# EAGLE design ESP32-Proto2-OSHPARK_Rev2 (EAGLE 9.6.2)
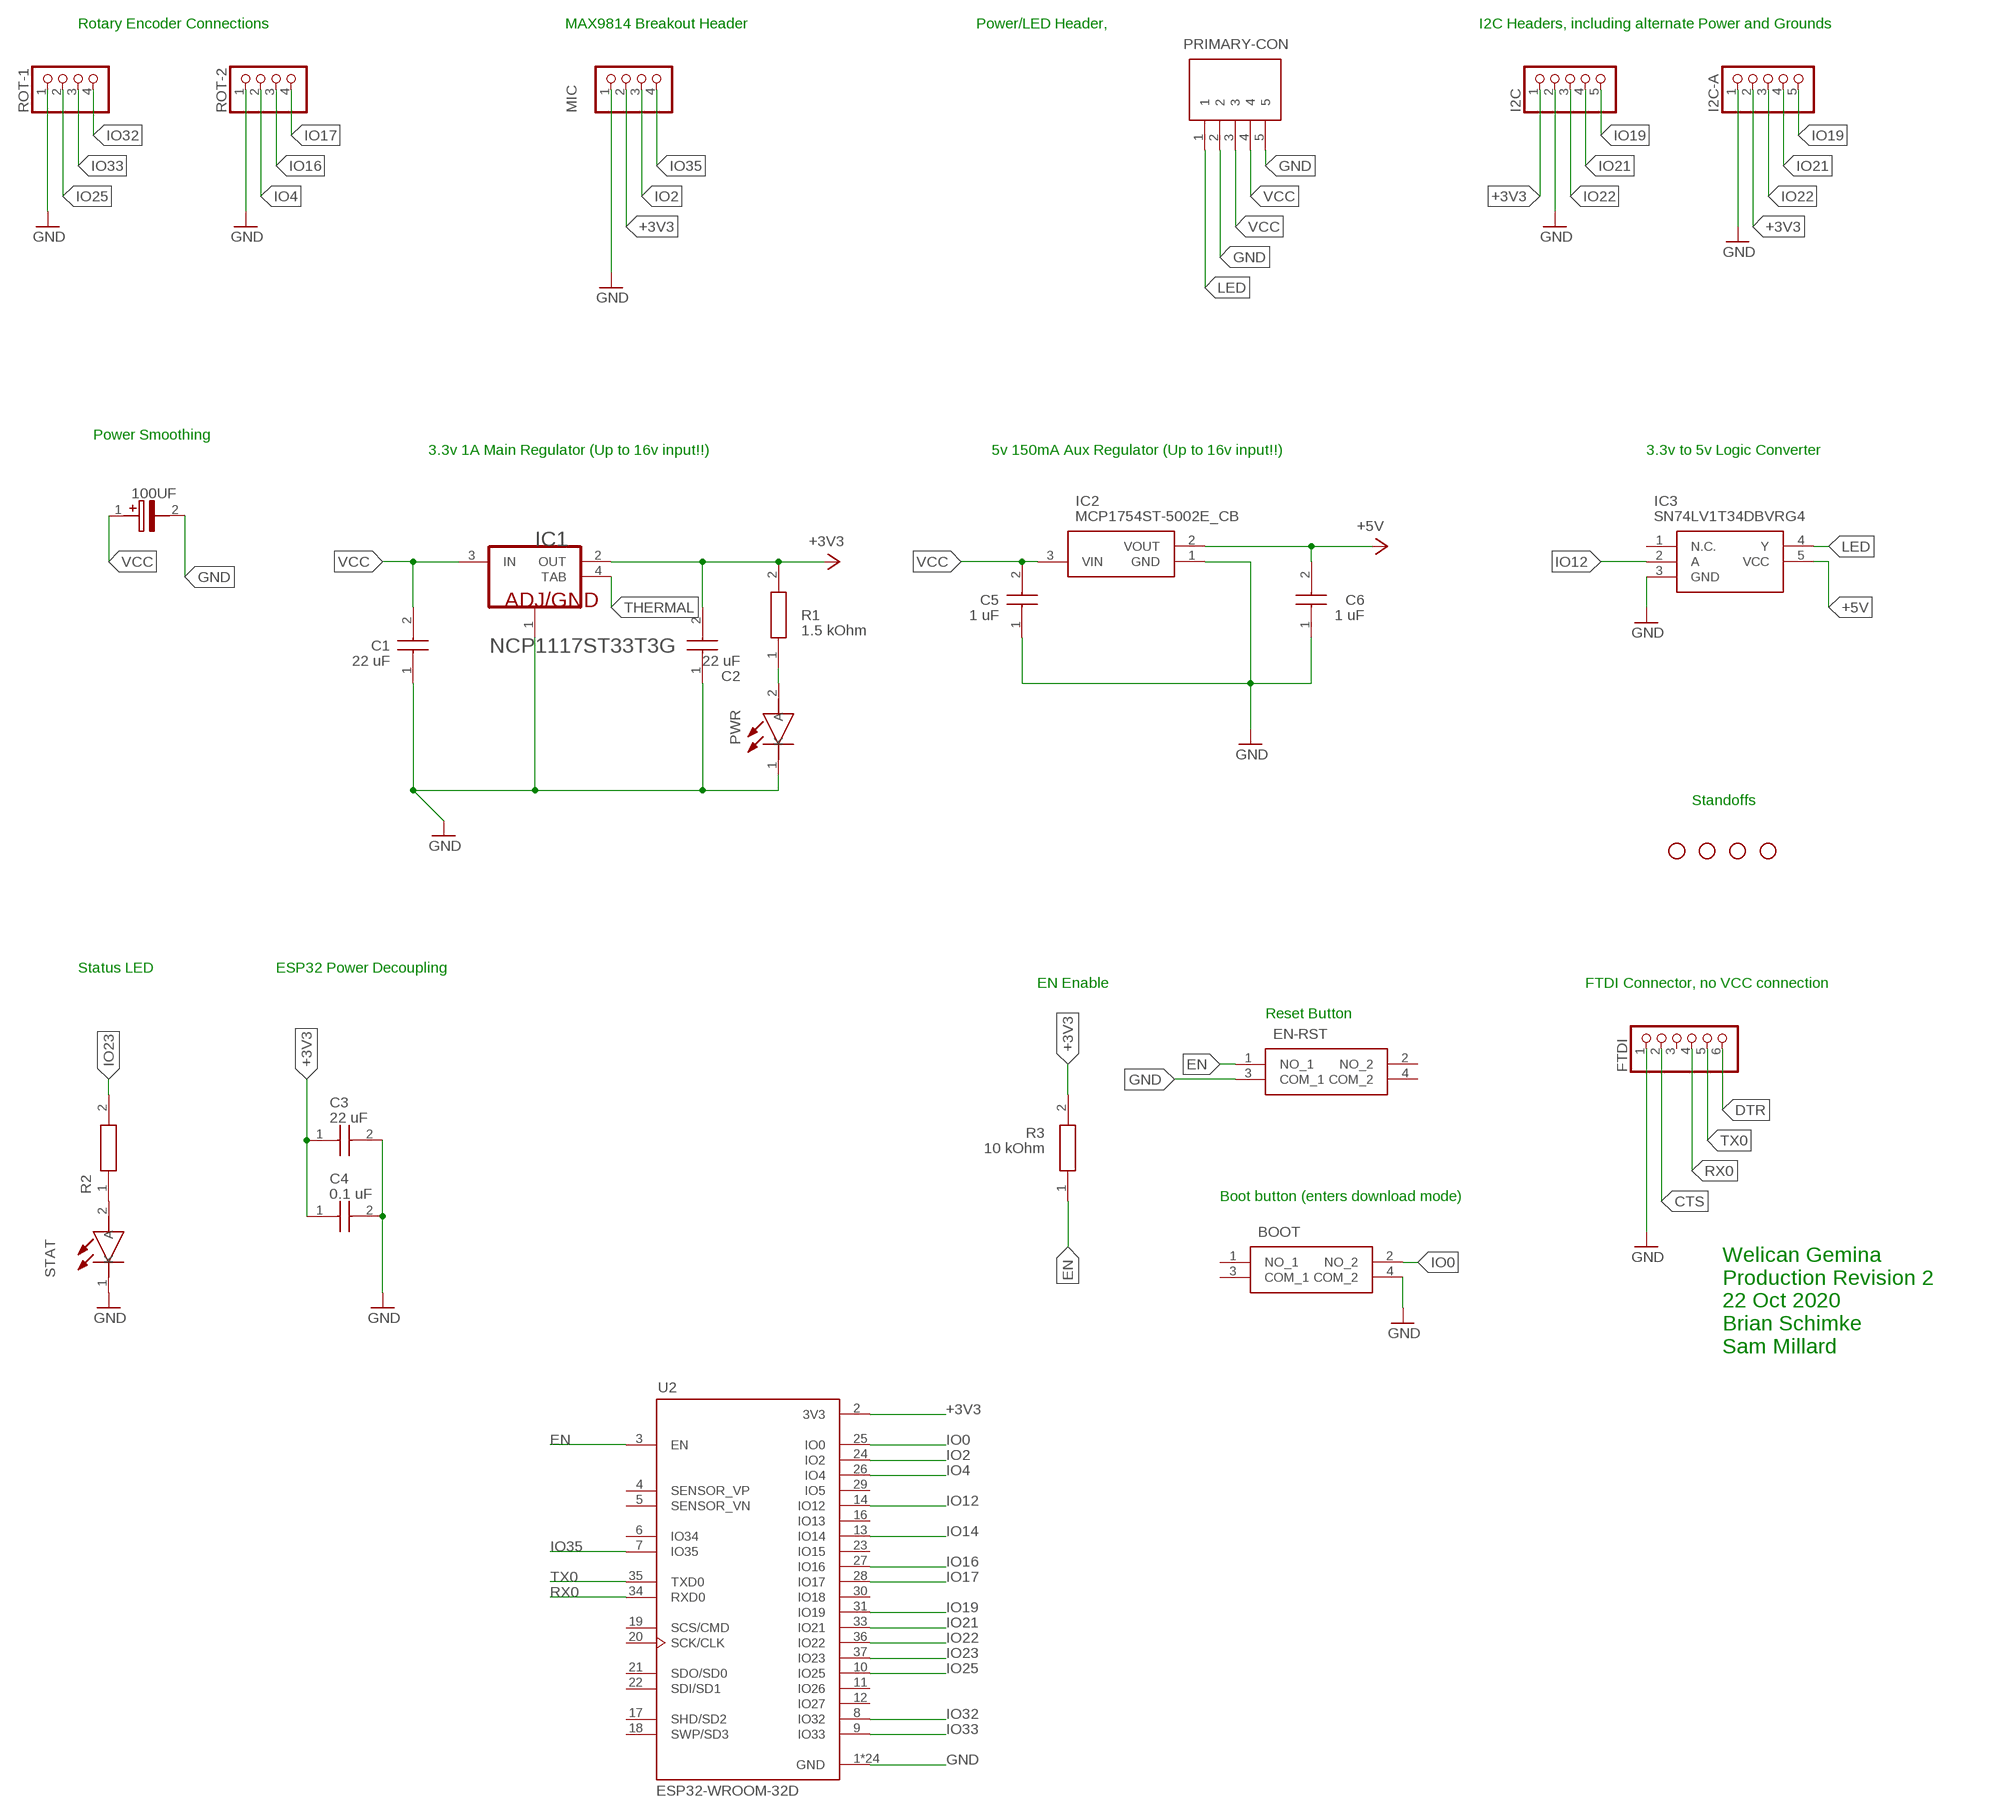
[diagram p0: schematic, sheet 1]

## Parts
100UF  865080445010  [CAPAE660X770N]
BOOT  PTS647SK70SMTR2LFS  [PTS647SK70SMTR2LFS]
C1  22 uF  C1206C226M4PACTU  [CAPC3216X180N]
C2  22 uF  C1206C226M4PACTU  [CAPC3216X180N]
C3  22 uF  C1206C226M4PACTU  [CAPC3216X180N]
C4  0.1 uF  C1206C226M4PACTU  [CAPC3216X180N]
C5  1 uF  C1206C226M4PACTU  [CAPC3216X180N]
C6  1 uF  C1206C226M4PACTU  [CAPC3216X180N]
EN-RST  PTS647SK70SMTR2LFS  [PTS647SK70SMTR2LFS]
FTDI  PINHD-1X6  [1X06]
H1  STAND-OFF  [STAND-OFF]
H2  STAND-OFF  [STAND-OFF]
H3  STAND-OFF  [STAND-OFF]
H4  STAND-OFF  [STAND-OFF]
I2C  PINHD-1X5  [1X05]
I2C-A  PINHD-1X5  [1X05]
IC1  ON_SEMICONDUCTOR_NCP1117ST33T3GON_SEMICONDUCTOR_NCP1117ST33T3G_0_0  [ON_SEMICONDUCTOR_NCP1117ST33T3G_0]
IC2  MCP1754ST-5002E_CB  [SOT95P255X145-3N]
IC3  SN74LV1T34DBVRG4  [SOT95P280X145-5N]
MIC  PINHD-1X4  [1X04]
PRIMARY-CON  1984646  [1984646]
PWR  150120AS75000  [LEDSC320X160X78-2N]
R1  1.5 kOhm  CRCW12061K00FKEB  [RESC3216X60N]
R2  CRCW12061K00FKEB  [RESC3216X60N]
R3  10 kOhm  CRCW12061K00FKEB  [RESC3216X60N]
ROT-1  PINHD-1X4  [1X04]
ROT-2  PINHD-1X4  [1X04]
STAT  150120AS75000  [LEDSC320X160X78-2N]
U2  ESP32-WROOM-32D  [MODULE_ESP32-WROOM-32D]

## Nets
+3V3: C2.2 C3.1 C4.1 I2C-A.2 I2C.1 IC1.2(OUT) MIC.2 R1.2 R3.2 U2.2(3V3)
+5V: C6.2 IC2.2(VOUT) IC3.5(VCC)
CTS: FTDI.2
DTR: FTDI.6
EN: EN-RST.1(NO_1) R3.1 U2.3(EN)
GND: 100UF.2(-) BOOT.4(COM_2) C1.1 C2.1 C3.2 C4.2 C5.1 C6.1 EN-RST.3(COM_1) FTDI.1 I2C-A.1 I2C.2 IC1.1(ADJ/GND) IC2.1(GND) IC3.3(GND) MIC.1 PRIMARY-CON.2 PRIMARY-CON.5 PWR.1(K) ROT-1.1 ROT-2.1 STAT.1(K) U2.1(GND) U2.15(GND) U2.38(GND) U2.39_1(GND) U2.39_2(GND) U2.39_3(GND) U2.39_4(GND) U2.39_5(GND) U2.39_6(GND) U2.39_7(GND) U2.39_8(GND) U2.39_9(GND) U2.39_10(GND) U2.39_11(GND) U2.39_12(GND) U2.39_13(GND) U2.39_14(GND) U2.39_15(GND) U2.39_16(GND) U2.39_17(GND) U2.39_18(GND) U2.39_19(GND) U2.39_20(GND) U2.39_21(GND)
IO0: BOOT.2(NO_2) U2.25(IO0)
IO2: MIC.3 U2.24(IO2)
IO4: ROT-2.2 U2.26(IO4)
IO12: IC3.2(A) U2.14(IO12)
IO14: U2.13(IO14)
IO16: ROT-2.3 U2.27(IO16)
IO17: ROT-2.4 U2.28(IO17)
IO19: I2C-A.5 I2C.5 U2.31(IO19)
IO21: I2C-A.4 I2C.4 U2.33(IO21)
IO22: I2C-A.3 I2C.3 U2.36(IO22)
IO23: R2.2 U2.37(IO23)
IO25: ROT-1.2 U2.10(IO25)
IO32: ROT-1.4 U2.8(IO32)
IO33: ROT-1.3 U2.9(IO33)
IO35: MIC.4 U2.7(IO35)
LED: IC3.4(Y) PRIMARY-CON.1
N$1: PWR.2(A) R1.1
N$2: R2.1 STAT.2(A)
RX0: FTDI.4 U2.34(RXD0)
THERMAL: IC1.4(TAB)
TX0: FTDI.5 U2.35(TXD0)
VCC: 100UF.1(+) C1.2 C5.2 IC1.3(IN) IC2.3(VIN) PRIMARY-CON.3 PRIMARY-CON.4
Unconnected: BOOT.1(NO_1) BOOT.3(COM_1) EN-RST.2(NO_2) EN-RST.4(COM_2) FTDI.3 IC3.1(N.C.) U2.4(SENSOR_VP) U2.5(SENSOR_VN) U2.6(IO34) U2.11(IO26) U2.12(IO27) U2.16(IO13) U2.17(SHD/SD2) U2.18(SWP/SD3) U2.19(SCS/CMD) U2.20(SCK/CLK) U2.21(SDO/SD0) U2.22(SDI/SD1) U2.23(IO15) U2.29(IO5) U2.30(IO18)

## Notes on the sheet
- Rotary Encoder Connections | MAX9814 Breakout Header | Power/LED Header, | I2C Headers, including alternate Power and Grounds
- Power Smoothing
- 3.3v 1A Main Regulator (Up to 16v input!!) | 5v 150mA Aux Regulator (Up to 16v input!!) | 3.3v to 5v Logic Converter
- Standoffs
- Status LED | ESP32 Power Decoupling
- EN Enable | FTDI Connector, no VCC connection
- Reset Button
- Boot button (enters download mode)
- Welican Gemina
  Production Revision 2
  22 Oct 2020
  Brian Schimke
  Sam Millard

## Library data of the parts
100UF = SamacSys_Parts:865080445010: Wurth Elektronik Aluminium Electrolytic Capacitor 100uF 25V dc 6.3mm V-Chip WCAP-ASLI Series Aluminium, Surface Mount Source: Datasheet <https://katalog.we-online.com/pbs/datasheet/865080445010.pdf>; DESCRIPTION: Wurth Elektronik Aluminium Electrolytic Capacitor 100uF 25V dc 6.3mm V-Chip WCAP-ASLI Series Aluminium, Surface Mount; HEIGHT: 7.7mm; MANUFACTURER_NAME: Wurth Elektronik; MANUFACTURER_PART_NUMBER: 865080445010; MOUSER_PART_NUMBER: 710-865080445010; MOUSER_PRICE-STOCK: https://www.mouser.co.uk/ProductDetail/Wurth-Elektronik/865080445010?qs=0KOYDY2FL29KjsP7WHszFQ%3D%3D
BOOT EN-RST = SamacSys_Parts:PTS647SK70SMTR2LFS: Tactile Switches 50mA 12VDC, 2.5N 7.0mm H, G leads Source: Datasheet <https:////www.ckswitches.com/media/2567/pts647.pdf>; DESCRIPTION: Tactile Switches 50mA 12VDC, 2.5N 7.0mm H, G leads; HEIGHT: 7.2mm; MANUFACTURER_NAME: C & K COMPONENTS; MANUFACTURER_PART_NUMBER: PTS647SK70SMTR2LFS; MOUSER_PART_NUMBER: 611-PTS647SK70SMTR2L; MOUSER_PRICE-STOCK: https://www.mouser.co.uk/ProductDetail/CK/PTS647SK70SMTR2LFS?qs=PqoDHHvF64%2FG2CdR6DYUFw%3D%3D
C1-C6 = SamacSys_Parts:C1206C226M4PACTU: KEMET 1206 (3216M) 22uF MLCC 16V dc +/-20% SMD C1206C226M4PACTU Source: Datasheet <https://api.kemet.com/component-edge/download/specsheet/C1206C226M4PACTU.pdf>; DESCRIPTION: KEMET 1206 (3216M) 22uF MLCC 16V dc +/-20% SMD C1206C226M4PACTU; HEIGHT: 1.8mm; MANUFACTURER_NAME: Kemet; MANUFACTURER_PART_NUMBER: C1206C226M4PACTU; MOUSER_PART_NUMBER: 80-C1206C226M4P; MOUSER_PRICE-STOCK: https://www.mouser.co.uk/ProductDetail/KEMET/C1206C226M4PACTU?qs=vBH1GPjCw2UZFSd%252B4IU1Qg%3D%3D
FTDI = pinhead:PINHD-1X6: PIN HEADER
H1-H4 = SparkFun-Hardware:STAND-OFF: Stand Off Drill holes for mechanically mounting via screws, standoffs, etc. Note: Use the keepout ring to avoid running the screw head into surrounding components. Variant Overviews STAND-OFF - Mechanical footprint for a #4 phillips button head screw. STAND-OFF-TIGHT - Mechanical footprint for a #4 phillips button head screw, Example SparkFun Products Screw - Phillips Head (1/4", 4-40, 10 pack) <https://www.sparkfun.com/products/10453> (PRT-10453) Screw - Phillips Head (1/2", 4-40, 10 pack) <https://www.sparkfun.com/products/10452> (PRT-10452) Screw - Phillips Head (3/4", 4-40, 10 pack) <https://www.sparkfun.com/products/10451> (PRT-10451) Screw - Phillips Head (1", 4-40, 10 pack) <https://www.sparkfun.com/products/10450> (PRT-10450)
I2C I2C-A = pinhead:PINHD-1X5: PIN HEADER
IC1 = ON Semiconductor - NCP1117ST33T3G:ON_SEMICONDUCTOR_NCP1117ST33T3G: ONSC-NCP1117-SOT223-4; CASE_CODE_IMPERIAL: 0603; CASE_CODE_METRIC: 1608; CASE_PACKAGE: 0603; CIIVA_IDS: 19354120; COMPONENT_LINK_1_DESCRIPTION: Manufacturer URL; COMPONENT_LINK_1_URL: http://www.onsemi.com/; DATASHEET: http://www.onsemi.com/pub_link/Collateral/NCP1117-D.PDF; DATASHEET_VERSION: Rev. 27, 09/2014; FOOTPRINT_VARIANT_NAME_0: Manufacturer Recommended; HEIGHT: 0.45 mm; IMPORTED: yes; IMPORTED_FROM: vault; IMPORT_TS: 1521845423; LENGTH: 1.55 mm; MAX_OPERATING_TEMPERATURE: 155 degC; MF: ON Semiconductor; MIN_OPERATING_TEMPERATURE: -55 degC; MOUNT: Surface Mount; MPN: NCP1117ST33T3G; PACKAGE: SOT-223-4-318H-01_A; PACKAGE_DESCRIPTION: 4-Pin Small Outline Transistor, Body 6.5 x 3.5 mm, Pitch 2.3 mm; PACKAGE_QUANTITY: 5000; PACKAGING: Tape and Reel; POWER_RATING: 100 mW; PREFIX: U; RADIATION_HARDENING: No; REACH_SVHC: Unknown; RELEASE_DATE: 1475065185; RESISTANCE: 220 kohm; RO_HSCOMPLIANT: true; TOLERANCE: 1%; TYPE_RESISTOR: Thick Film; VAULT_GUID: C6E429D0-32F2-4CA3-9C68-29F3FC9DADEB; VAULT_REVISION: 6AD56B9F-4B97-41F2-91E8-97C557B92B31; VOLTAGE_RATING: 75 V; WEIGHT: 7.1E-05 oz; WIDTH: 0.85 mm
IC2 = SamacSys_Parts:MCP1754ST-5002E_CB: LDO regulator,voltage,5.0V,150mA,SOT23A Microchip MCP1754ST-5002E/CB, Single Linear Voltage Regulator, 150mA 5 V, 2%, 3-Pin SOT-23A Source: Datasheet; DESCRIPTION: LDO regulator,voltage,5.0V,150mA,SOT23A Microchip MCP1754ST-5002E/CB, Single Linear Voltage Regulator, 150mA 5 V, 2%, 3-Pin SOT-23A; HEIGHT: 1.45mm; MANUFACTURER_NAME: Microchip; MANUFACTURER_PART_NUMBER: MCP1754ST-5002E/CB; MOUSER_PART_NUMBER: 579-MCP1754T-5002ECB; MOUSER_PRICE-STOCK: https://www.mouser.co.uk/ProductDetail/Microchip-Technology/MCP1754ST-5002E-CB?qs=geWWqIMx8YpBnNSotTcMsA%3D%3D
IC3 = SamacSys_Parts:SN74LV1T34DBVRG4: Single Power Supply BUFFER Logic Level Shifter (no enable) Source: Datasheet <http://www.ti.com/lit/gpn/sn74lv1t34>; DESCRIPTION: Single Power Supply BUFFER Logic Level Shifter (no enable); HEIGHT: 1.45mm; MANUFACTURER_NAME: Texas Instruments; MANUFACTURER_PART_NUMBER: SN74LV1T34DBVRG4; MOUSER_PART_NUMBER: 595-SN74LV1T34DBVRG4; MOUSER_PRICE-STOCK: https://www.mouser.co.uk/ProductDetail/Texas-Instruments/SN74LV1T34DBVRG4?qs=vdi0iO8H4N10R%252Bt%252BjmxZrg%3D%3D
MIC ROT-1 ROT-2 = pinhead:PINHD-1X4: PIN HEADER
PRIMARY-CON = SamacSys_Parts:1984646: Phoenix Contact, COMBICON PT 3.5mm Pitch, 5 Way PCB Terminal Strip Source: Datasheet <https://www.phoenixcontact.com/online/portal/in?uri=pxc-oc-itemdetail:pid=1984646&library=inen&tab=1>; DESCRIPTION: Phoenix Contact, COMBICON PT 3.5mm Pitch, 5 Way PCB Terminal Strip; HEIGHT: 9.3mm; MANUFACTURER_NAME: Phoenix Contact; MANUFACTURER_PART_NUMBER: 1984646
PWR STAT = SamacSys_Parts:150120AS75000: WL-SMCW SMD chip LED top view monocolor%D waterclear Source: Datasheet <http://katalog.we-online.com/led/datasheet/150120AS75000.pdf>; DESCRIPTION: WL-SMCW SMD chip LED top view monocolor%D waterclear; HEIGHT: mm; MANUFACTURER_NAME: Wurth Elektronik; MANUFACTURER_PART_NUMBER: 150120AS75000; MOUSER_PART_NUMBER: 710-150120AS75000; MOUSER_PRICE-STOCK: https://www.mouser.co.uk/ProductDetail/Wurth-Elektronik/150120AS75000?qs=LlUlMxKIyB3dthGDbNsiXQ%3D%3D
R1-R3 = SamacSys_Parts:CRCW12061K00FKEB: Thick Film Resistors - SMD 1/4watt 1Kohms 1% Source: Datasheet <http://www.vishay.com/docs/20035/dcrcwe3.pdf>; DESCRIPTION: Thick Film Resistors - SMD 1/4watt 1Kohms 1%; HEIGHT: 0.6mm; MANUFACTURER_NAME: Vishay; MANUFACTURER_PART_NUMBER: CRCW12061K00FKEB; MOUSER_PART_NUMBER: 71-CRCW12061K00FKEB; MOUSER_PRICE-STOCK: https://www.mouser.co.uk/ProductDetail/Vishay-Dale/CRCW12061K00FKEB?qs=3XLFQ9LoC1wOYUVdt2fbOg%3D%3D
U2 = ESP32-WROOM-32D:ESP32-WROOM-32D: Bluetooth, WiFi 802.11b/g/n, Bluetooth v4.2 + EDR, Class 1, 2 and 3 Transceiver Module 2.4GHz ~ 2.5GHz Integrated, Trace Surface Mount Check prices <https://pricing.snapeda.com/search/part/ESP32-WROOM-32D/?ref=eda>; AVAILABILITY: Bad; DESCRIPTION: Bluetooth, WiFi 802.11b/g/n, Bluetooth v4.2 +EDR, Class 1, 2 and 3 Transceiver Module 2.4GHz ~ 2.5GHz Integrated, Trace Surface Mount; MF: Espressif Systems; MP: ESP32-WROOM-32D; PACKAGE: Module Espressif Systems; PRICE: None

## Board
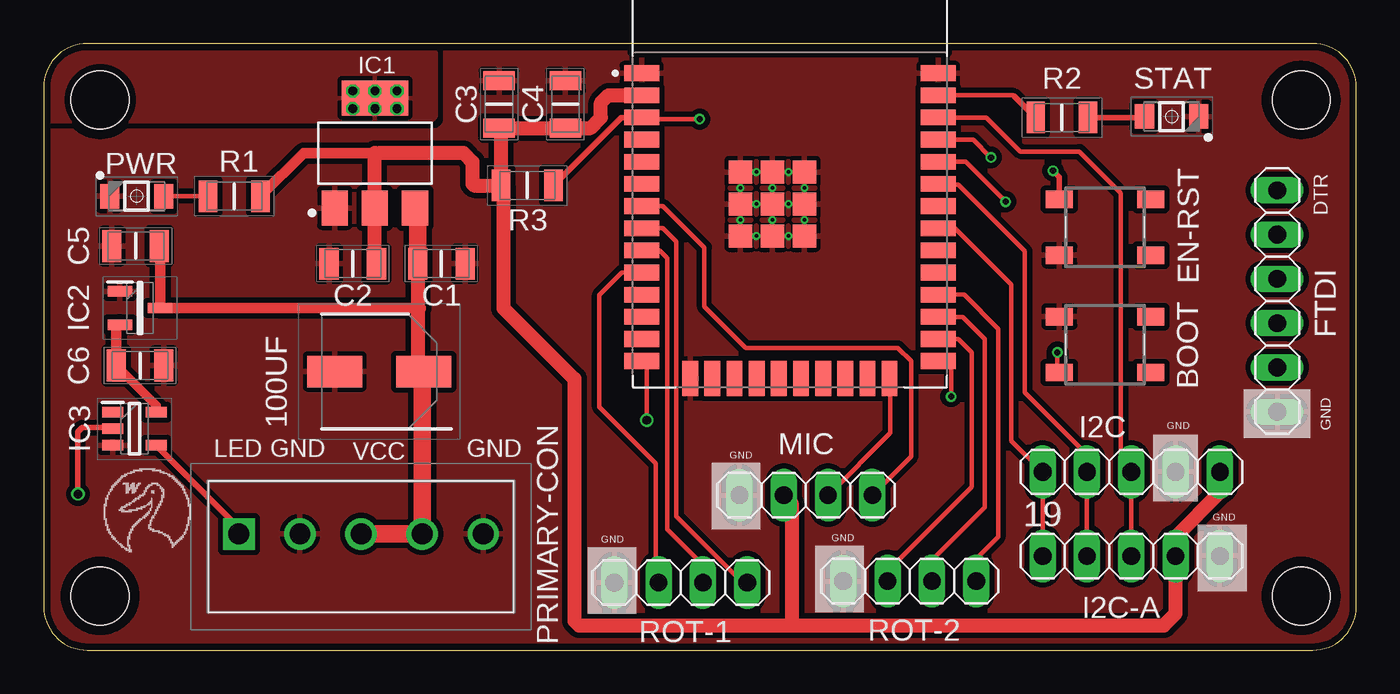
[diagram p1: board, top side]
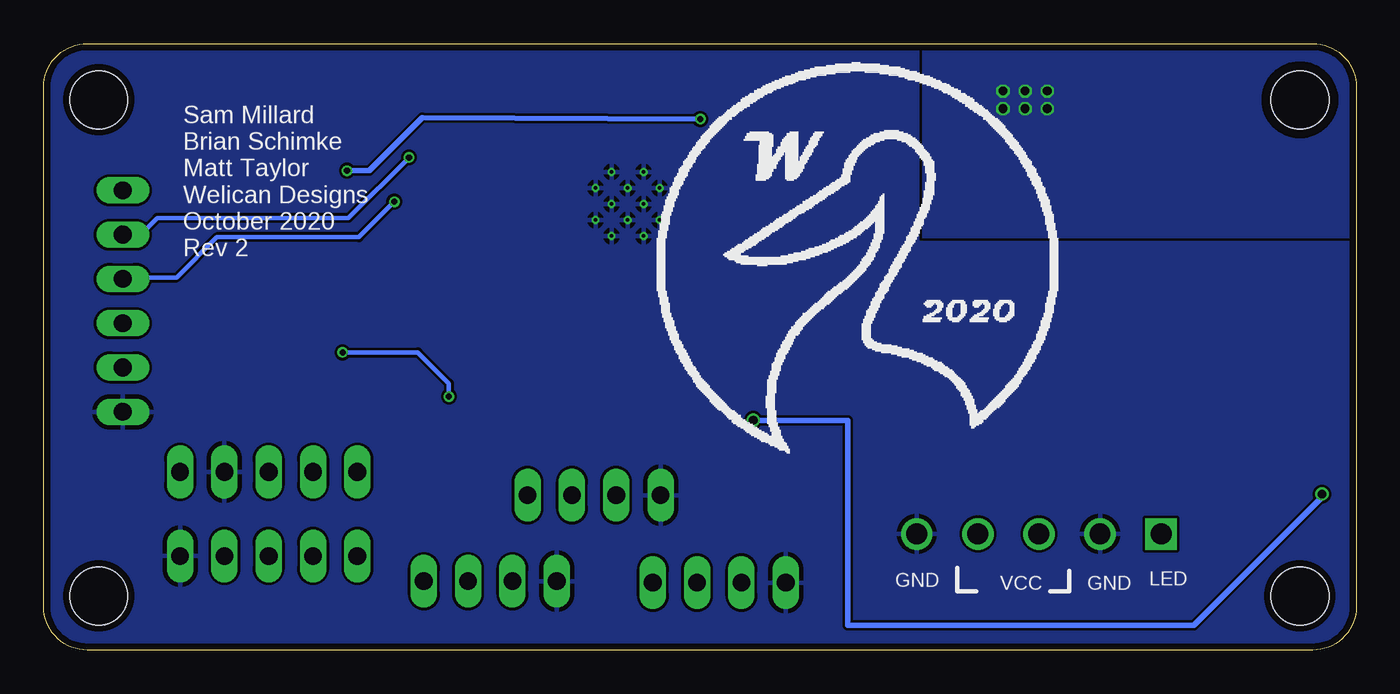
[diagram p2: board, bottom side, seen from below]

Size 75.23 x 34.79 mm. Coordinates in mm from the lower left corner, seen from the top.
Outline: 75.23,2.5 75.23,32.29 arc90 72.73,34.79 2.5,34.79 arc90 0,32.29 0,2.5 arc90 2.5,0 72.73,0 arc90 75.23,2.5
Copper layers (1*16): Top 0.035559375mm / dielectric 1.6mm / Bottom 0.035559375mm
Design rules "oshpark-2layer": minimum track width 6mil, minimum drill 10mil, track to track 6mil, track to pad 6mil, pad to pad 6mil, via to via 6mil, smd to smd 6mil, copper to edge 15mil, drill to drill 6mil, minimum pad ring 5mil, minimum via ring 5mil, stop-mask expansion 2.5mil, vias tented up to drill 0mil, thermal gap 10mil

### Footprints (pad centres in the part's own frame; a part is rotated, then mirrored left to right if it is on the bottom)
CAPAE660X770N = smd 3.15 x 1.8: 1 -2.55,0; 2 2.55,0
PTS647SK70SMTR2LFS = smd 1.55 x 1: 1 -2.625,1.6; 2 2.625,1.6; 3 -2.625,-1.6; 4 2.625,-1.6
CAPC3216X180N = smd 1.1 x 1.82: 1 -1.36,0; 2 1.36,0
1X06 = drill 1.016 long: 1 -6.35,0; 2 -3.81,0; 3 -1.27,0; 4 1.27,0; 5 3.81,0; 6 6.35,0
STAND-OFF = hole 3.302: 0,0
1X05 = drill 1.016 long: 1 -5.08,0; 2 -2.54,0; 3 0,0; 4 2.54,0; 5 5.08,0
ON_SEMICONDUCTOR_NCP1117ST33T3G_0 = smd 2 x 1.5: 1 -3.15,2.3; 2 -3.15,0; 3 -3.15,-2.3 | smd 2 x 3.8: 4 3.15,0
SOT95P255X145-3N = smd 1.4 x 0.6: 1 -1.15,0.95; 2 -1.15,-0.95; 3 1.15,0
SOT95P280X145-5N = smd 1.2 x 0.6: 1 -1.25,0.95; 2 -1.25,0; 3 -1.25,-0.95; 4 1.25,-0.95; 5 1.25,0.95
1X04 = drill 1.016 long: 1 -3.81,0; 2 -1.27,0; 3 1.27,0; 4 3.81,0
1984646 = drill 1.2 pad 1.8 square: 1 0,0 | drill 1.2 pad 1.8: 2 3.5,0; 3 7,0; 4 10.5,0; 5 14,0
LEDSC320X160X78-2N = smd 1.1 x 1.4: 1 -1.55,0; 2 1.55,0
RESC3216X60N = smd 1.05 x 1.8: 1 -1.5,0; 2 1.5,0
MODULE_ESP32-WROOM-32D = smd 2 x 0.9: 1 -8.5,5.26; 2 -8.5,3.99; 3 -8.5,2.72; 4 -8.5,1.45; 5 -8.5,0.18; 6 -8.5,-1.09; 7 -8.5,-2.36; 8 -8.5,-3.63; 9 -8.5,-4.9; 10 -8.5,-6.17; 11 -8.5,-7.44; 12 -8.5,-8.71; 13 -8.5,-9.98; 14 -8.5,-11.25; 25 8.5,-11.25; 26 8.5,-9.98; 27 8.5,-8.71; 28 8.5,-7.44; 29 8.5,-6.17; 30 8.5,-4.9; 31 8.5,-3.63; 32 8.5,-2.36; 33 8.5,-1.09; 34 8.5,0.18; 35 8.5,1.45; 36 8.5,2.72; 37 8.5,3.99; 38 8.5,5.26 | smd 0.9 x 2: 15 -5.715,-12.25; 16 -4.445,-12.25; 17 -3.175,-12.25; 18 -1.905,-12.25; 19 -0.635,-12.25; 20 0.635,-12.25; 21 1.905,-12.25; 22 3.175,-12.25; 23 4.445,-12.25; 24 5.715,-12.25 | smd 1.33 x 1.33: 39_1 -2.835,-0.405; 39_2 -1,-0.405; 39_3 0.835,-0.405; 39_4 -2.835,-2.24; 39_5 -1,-2.24; 39_6 0.835,-2.24; 39_7 -2.835,-4.075; 39_8 -1,-4.075; 39_9 0.835,-4.075 | drill 0.2 pad 0.3: 39_10 -1.917,-0.405; 39_11 -0.083,-0.405; 39_12 -2.835,-1.323; 39_13 -1,-1.323; 39_14 0.835,-1.323; 39_15 -1.917,-2.24; 39_16 -0.083,-2.24; 39_17 -2.835,-3.158; 39_18 -1,-3.158; 39_19 0.835,-3.158; 39_20 -1.917,-4.075; 39_21 -0.083,-4.075

### Placement (x,y rotation side)
100UF  19.24,15.98 180 top
BOOT  60.83,17.53 180 top
C1  22.8,22.16 180 top
C2  17.72,22.16 0 top
C3  26.1,31.31 90 top
C4  29.91,31.31 90 top
C5  5.27,23.18 0 top
C6  5.52,16.32 180 top
EN-RST  60.83,24.26 0 top
FTDI  70.7,20.02 90 top
H1  3.24,31.56 0 top
H2  72.07,3.11 0 top
H3  72.07,31.56 0 top
H4  3.24,3.11 0 top
I2C  62.34,10.22 180 top
I2C-A  62.34,5.4 180 top
IC1  18.99,28.51 90 top
IC2  5.52,19.62 0 top
IC3  5.21,12.7 0 top
MIC  43.69,8.89 0 top
PRIMARY-CON  11.19,6.66 0 top
PWR  5.33,26.04 0 top
R1  10.92,26.04 0 top
R2  58.36,30.54 180 top
R3  27.71,26.65 180 top
ROT-1  36.51,3.87 0 top
ROT-2  49.64,3.96 0 top
STAT  64.64,30.61 180 top
U2  42.77,27.83 0 top

### Tracks (layer width: path | path; a pad name or v marks a point on that pad's centre or on a via)
+3V3
  Top 0.508: 24.57,26.73 24.66,26.65 | 26.21,29.83 C3.1
  Top 0.61: 19.24,28.51 18.99,28.51 14.9,28.51 R1.2
  Top 0.813: 19.24,28.51 24.07,28.51 24.57,28 24.57,26.73 | 24.66,26.65 R3.2 | R3.2 26.21,29.83 | C3.1 C4.1 31.34,29.95 31.94,30.54 31.94,31.39 32.37,31.82 U2.2 | R3.2 26.35,26.51 26.35,19.62 30.42,15.56 30.42,1.68 30.67,1.42 42.86,1.42 | 42.86,1.42 64.2,1.42 64.88,2.1 I2C-A.2 64.88,6.51 67.42,9.05 I2C.1 | MIC.2 42.86,8.45 42.86,1.42 | C2.2 18.99,22.16 IC1.2 18.99,28.51
+5V
  Top 0.508: C6.2 6.46,14.03 IC3.5
  Top 0.61: C6.2 4.16,18.46 IC2.2
EN  (via drill 0.35)
  Top 0.254: v37.6,30.46 34.36,30.46 U2.3
  Top 0.305: v57.85,27.5 58.21,27.14 EN-RST.1 | U2.3 33.11,30.55 R3.1
  Bottom 0.305: v37.6,30.46 53.53,30.54 56.58,27.5 v57.85,27.5
GND
  pour Top (isolate 0.305, rank 2): 0.19,34.61 75.12,34.61 75.12,0.06 0.19,0.06
  pour Bottom (rank 2): 0.19,0.06 75.12,0.06 75.12,34.61 74.87,34.61 0.19,34.35
IO0  (via drill 0.35)
  Top 0.152: U2.25 51.91,16.58 52.01,16.48
  Top 0.254: BOOT.2 58.1,16.03 v58.1,17.08 | 52.01,16.48 v52.01,14.54
  Bottom 0.254: v58.1,17.08 53.78,17.08 52.01,15.3 v52.01,14.54
IO2
  Top 0.254: MIC.3 48.53,12.46 48.53,15.54 U2.24
IO4
  Top 0.254: U2.26 52.41,17.85 53.18,17.08 53.18,9.37 48.37,4.55 ROT-2.2
IO12  (via drill 0.5)
  Top 0.254: U2.14 34.57,16.28 v34.57,13.19
  Top 0.305: v1.97,8.95 1.97,12.51 2.22,12.76 3.89,12.76 IC3.2
  Bottom 0.305: v34.57,13.19 29.15,13.19 29.15,1.42 9.33,1.42 1.97,8.79 v1.97,8.95
IO16
  Top 0.254: ROT-2.3 50.91,5.14 53.95,8.18 53.95,17.85 52.68,19.12 U2.27
IO17
  Top 0.254: ROT-2.4 53.45,5.23 54.71,6.49 54.71,18.43 52.75,20.39 U2.28
IO19
  Top 0.254: I2C.5 55.47,12.01 55.47,20.97 52.08,24.36 51.43,24.36 U2.31 | I2C.5 | I2C.5 I2C-A.5
IO21
  Top 0.152: U2.33 51.27,26.7
  Top 0.254: 51.27,26.7 52.41,26.7 56.23,22.88 56.23,14.79 59.45,11.58 59.53,11.58 59.8,11.31 I2C.4 | I2C.4 | I2C.4 I2C-A.4
IO22
  Top 0.254: U2.36 54.02,30.55 55.98,28.59 59.36,28.59 61.73,26.22 61.73,10.83 I2C.3 I2C-A.3 | I2C-A.3
IO23
  Top 0.254: 55.64,31.76 55.58,31.82 U2.37
  Top 0.305: R2.2 55.64,31.76
IO25
  Top 0.254: ROT-1.2 35.07,4.04 35.07,10.72 31.85,13.95 31.85,20.38 33.13,21.66 U2.10
IO32
  Top 0.152: U2.8 34.39,24.19
  Top 0.254: 34.39,24.19 35.5,24.19 36.26,23.43 36.26,7.68 40.07,3.87 ROT-1.4
IO33
  Top 0.254: ROT-1.3 37.78,4.89 35.75,6.92 35.75,22.5 35.32,22.93 U2.9
IO35
  Top 0.152: U2.7 34.72,25.47 34.73,25.46
  Top 0.254: MIC.4 49.72,11.11 49.72,16.57 48.96,17.34 40.24,17.34 37.87,19.71 37.87,23.09 35.5,25.46 34.73,25.46
LED
  Top 0.152: PRIMARY-CON.1
  Top 0.305: IC3.4 11.19,7.01 PRIMARY-CON.1
N$1
  Top 0.254: R1.1 PWR.2
N$2
  Top 0.305: STAT.2 63.03,30.54 R2.1
RX0  (via drill 0.35)
  Top 0.254: U2.34 52.85,28.01 v55.14,25.72
  Bottom 0.254: v55.14,25.72 57.17,23.69 65.3,23.69 67.61,21.38 70.61,21.38 FTDI.4
THERMAL  (via drill 0.5)
  other vias: 17.72,32.07 18.99,32.07 20.26,32.07 20.26,31.05 18.99,31.05 17.72,31.05
  pour Top: 1.97,34.61 22.03,34.61 arc-90 22.54,34.1 22.54,30.8 arc-90 22.03,30.29 -0.06,30.29 -0.06,32.58 arc-90
  pour Bottom (isolate 0.254): 1.71,34.35 24.83,34.35 24.83,23.69 0.44,23.69 0.44,33.08 arc-90
TX0  (via drill 0.35)
  Top 0.254: U2.35 53.27,29.28 v54.29,28.26
  Bottom 0.254: v54.29,28.26 57.76,24.79 68.73,24.79 69.68,23.83 FTDI.5
VCC
  Top 0.254: IC1.3 21.44,25.21
  Top 0.61: 21.53,19.62 IC2.3 6.67,23.13 C5.2
  Top 0.813: C1.2 21.44,19.71 | 21.44,19.71 21.53,19.62 | 21.44,19.71 21.44,16.14 21.69,15.88
  Top 1.016: 21.44,25.21 C1.2 | PRIMARY-CON.3 PRIMARY-CON.4 21.69,15.88 100UF.1

### Text on the board
bPlace: LED | GND | VCC | GND
tNames: DTR | GND | GND | LED | GND | GND | VCC | GND | 19 | GND | GND | GND
bNames: Sam Millard / Brian Schimke / Matt Taylor / Welican Designs / October 2020 / Rev 2